# Altium project Breakout_ER-TFT1.28-2.PrjPcb
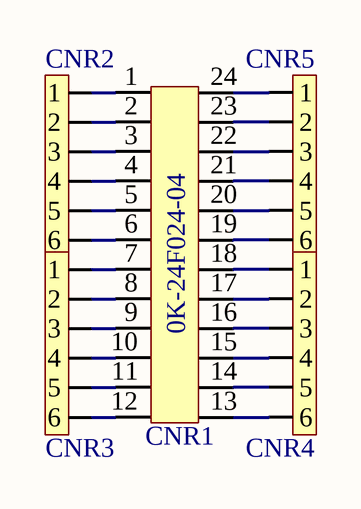
[diagram p0: Breakout_ER-TFT1.28-2.SchDoc]
1 sheet, 5 parts. Net scope: global (net labels, ports and power ports of the same name join across sheets).
Board file: Breakout_ER-TFT1.28-2.PcbDoc

## Sheet Breakout_ER-TFT1.28-2.SchDoc
size A4; SheetNumber: 1; SheetTotal: 1

### Parts
CNR1  0K-24F024-04  [0K-24F024-04]
CNR2  - CNR-IDC:6x1  [SIP06-2.54P]  (value not drawn)
CNR3  (no value)  [SIP06-2.54P]
CNR4  (no value)  [SIP06-2.54P]
CNR5  (no value)  [SIP06-2.54P]

### Nets
NetCNR1_1: CNR1.1 CNR2.1
NetCNR1_2: CNR1.2 CNR2.2
NetCNR1_3: CNR1.3 CNR2.3
NetCNR1_4: CNR1.4 CNR2.4
NetCNR1_5: CNR1.5 CNR2.5
NetCNR1_6: CNR1.6 CNR2.6
NetCNR1_7: CNR1.7 CNR3.1
NetCNR1_8: CNR1.8 CNR3.2
NetCNR1_9: CNR1.9 CNR3.3
NetCNR1_10: CNR1.10 CNR3.4
NetCNR1_11: CNR1.11 CNR3.5
NetCNR1_12: CNR1.12 CNR3.6
NetCNR1_13: CNR1.13 CNR4.6
NetCNR1_14: CNR1.14 CNR4.5
NetCNR1_15: CNR1.15 CNR4.4
NetCNR1_16: CNR1.16 CNR4.3
NetCNR1_17: CNR1.17 CNR4.2
NetCNR1_18: CNR1.18 CNR4.1
NetCNR1_19: CNR1.19 CNR5.6
NetCNR1_20: CNR1.20 CNR5.5
NetCNR1_21: CNR1.21 CNR5.4
NetCNR1_22: CNR1.22 CNR5.3
NetCNR1_23: CNR1.23 CNR5.2
NetCNR1_24: CNR1.24 CNR5.1

### Library data of the parts
CNR1 = >CNR:IDC-2x12: 24 Pins 0.4mm Pitch ZIF Connector
CNR3-CNR5 = - CNR-IDC:6x1: Cmmt: -
CNR2 = - CNR-IDC:6x1: Cmmt: -